# EAGLE design RPi_relay_board (EAGLE 6.4)
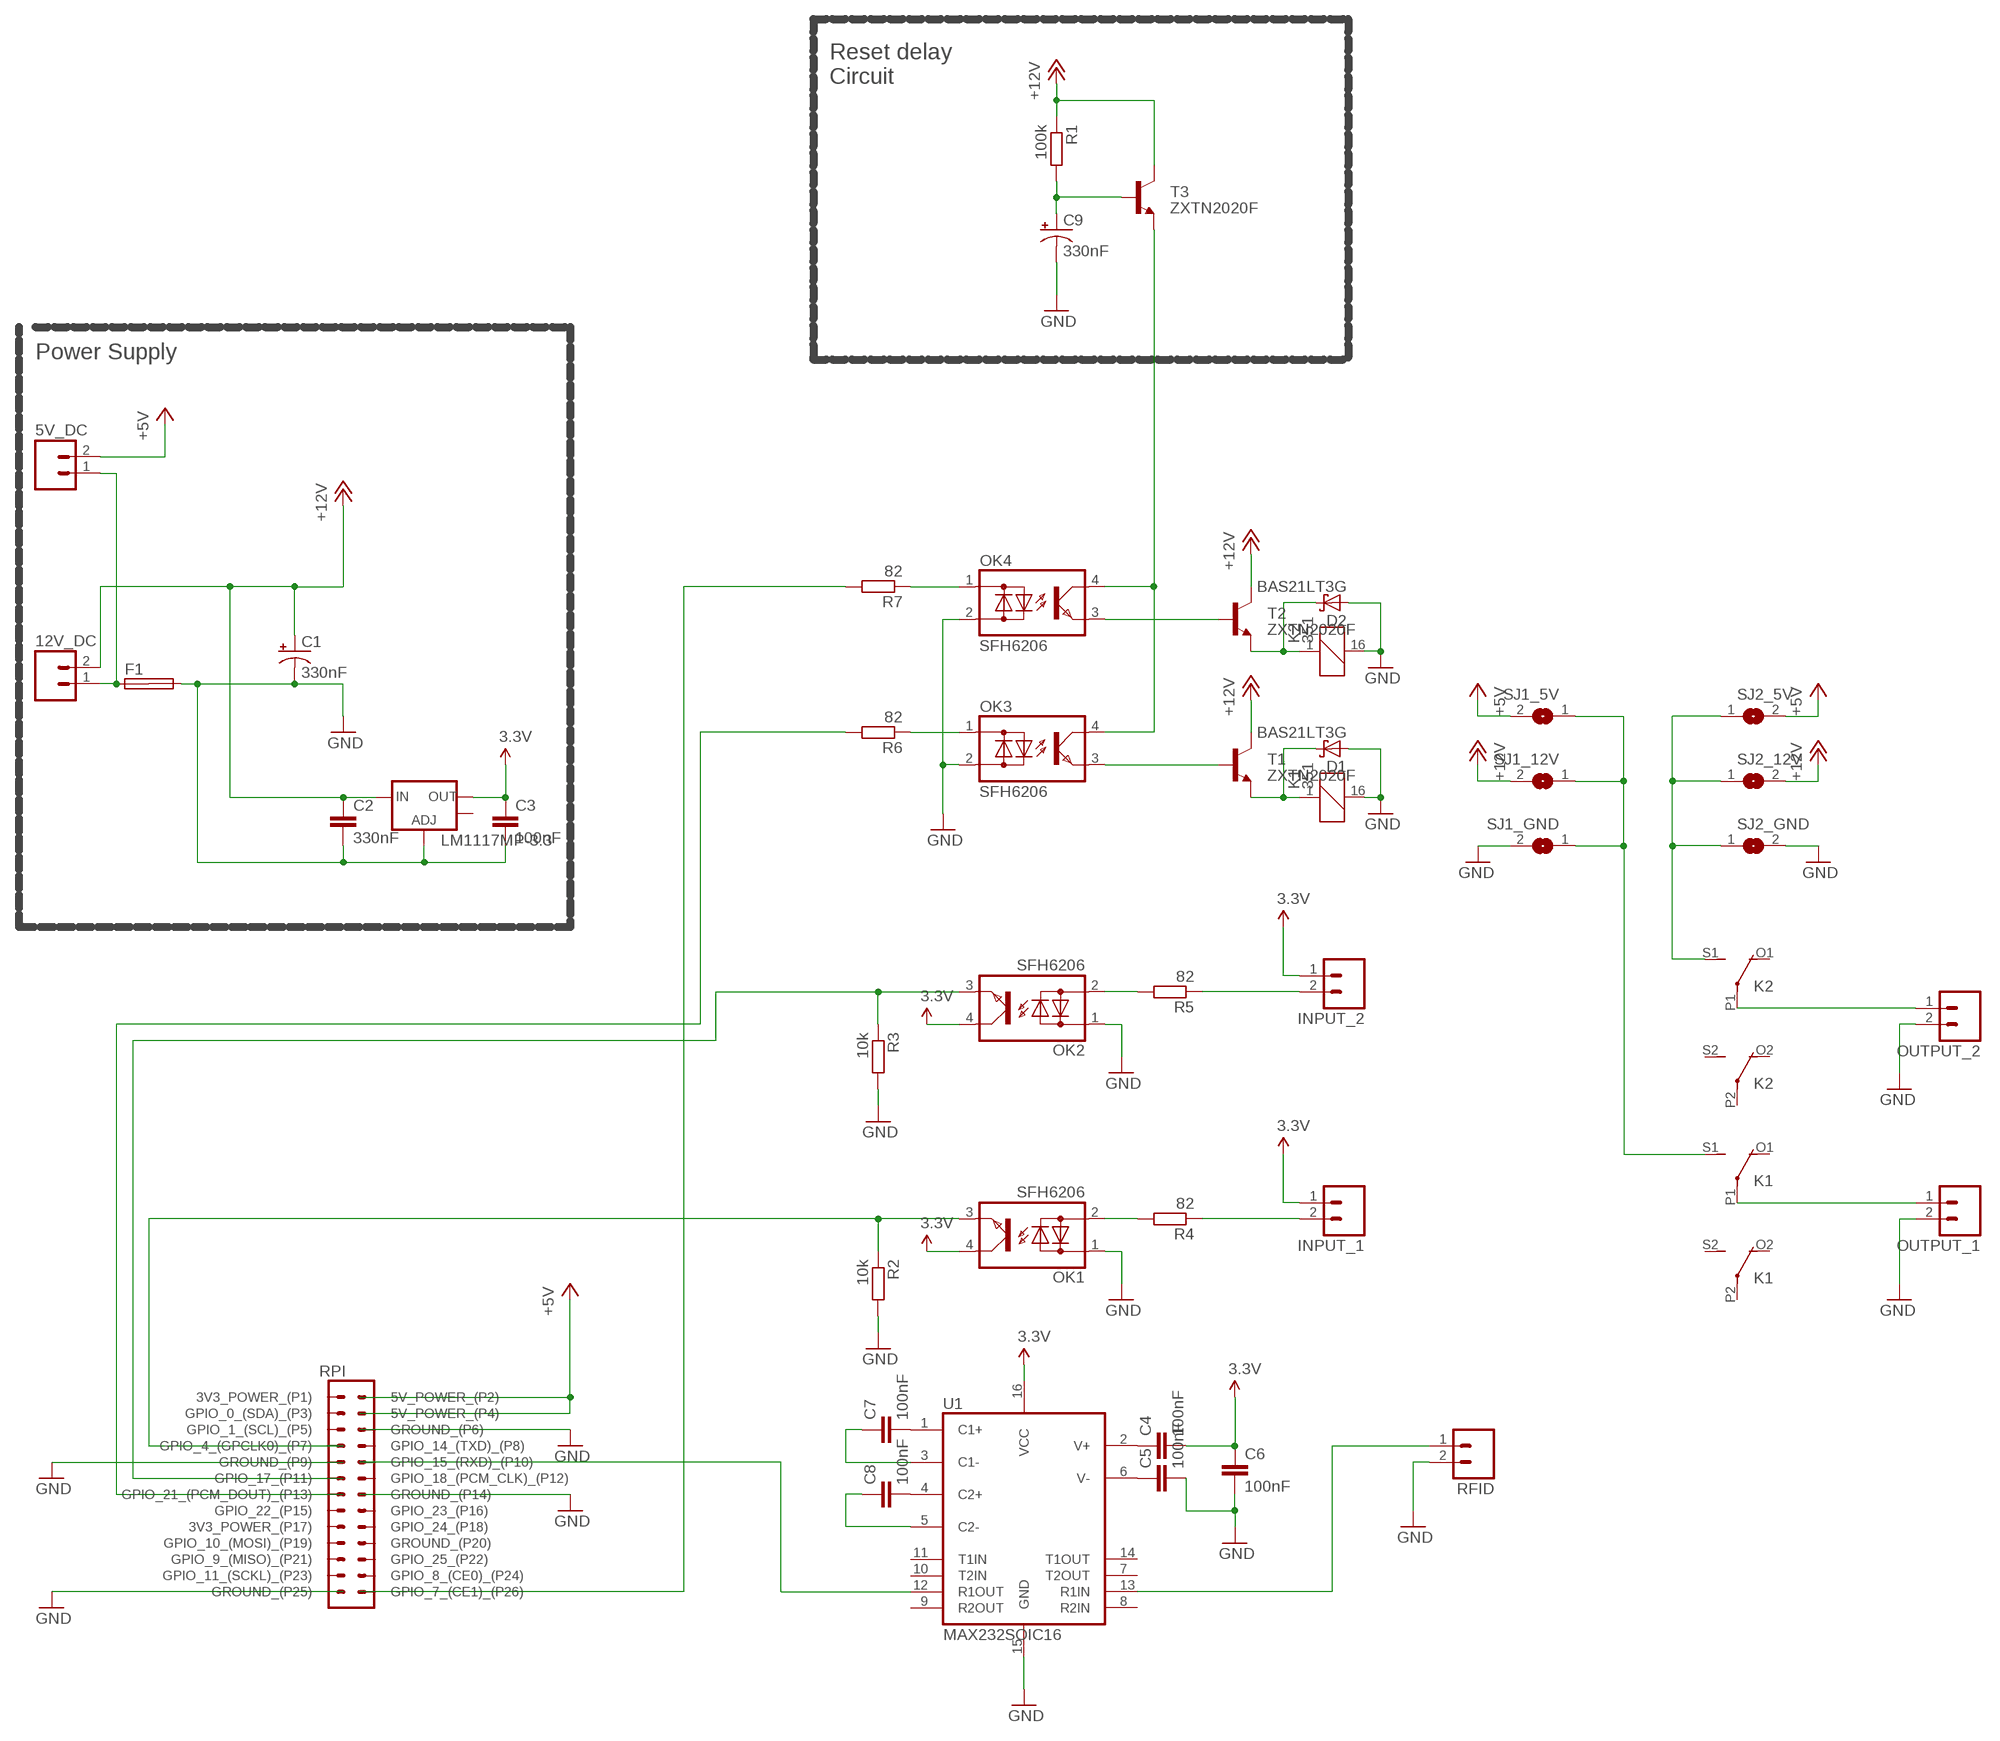
[diagram p0: schematic, sheet 1]

## Parts
5V_DC  M02PTH3_5MM  [1X02_LONGPADS]
12V_DC  M02PTH3_5MM  [1X02_LONGPADS]
C1  330nF  CAP_POL7343  [EIA7343]
C2  330nF  C-EUC3216  [C3216]
C3  100nF  C-EUC3216  [C3216]
C4  100nF  C-EUC2012  [C2012]
C5  100nF  C-EUC2012  [C2012]
C6  100nF  C-EUC2012  [C2012]
C7  100nF  C-EUC2012  [C2012]
C8  100nF  C-EUC2012  [C2012]
C9  330nF  CAP_POL7343  [EIA7343]
D1  BAS21LT3G  BAS40  [SOT23]
D2  BAS21LT3G  BAS40  [SOT23]
F1  SHK20L  [SHK20L]
INPUT_1  M02PTH3_5MM  [1X02_LONGPADS]
INPUT_2  M02PTH3_5MM  [1X02_LONGPADS]
K1  351  [351]
K2  351  [351]
LM1117MP-3.3  V_REG_LM1117SOT223  [SOT223]
OK1  SFH6206  [DIL4-SMD]
OK2  SFH6206  [DIL4-SMD]
OK3  SFH6206  [DIL4-SMD]
OK4  SFH6206  [DIL4-SMD]
OUTPUT_1  M02PTH3_5MM  [1X02_LONGPADS]
OUTPUT_2  M02PTH3_5MM  [1X02_LONGPADS]
R1  100k  R-EU_M0805  [M0805]
R2  10k  R-EU_M0805  [M0805]
R3  10k  R-EU_M0805  [M0805]
R4  82  R-EU_M0805  [M0805]
R5  82  R-EU_M0805  [M0805]
R6  82  R-EU_M0805  [M0805]
R7  82  R-EU_M0805  [M0805]
RFID  M02PTH3_5MM  [1X02_LONGPADS]
RPI  PINHD-2X13  [2X13]
SJ1_5V  SJW  [SJW]
SJ1_12V  SJW  [SJW]
SJ1_GND  SJW  [SJW]
SJ2_5V  SJW  [SJW]
SJ2_12V  SJW  [SJW]
SJ2_GND  SJW  [SJW]
T1  ZXTN2020F  TRANSISTOR_NPNSOT23  [SOT23]
T2  ZXTN2020F  TRANSISTOR_NPNSOT23  [SOT23]
T3  ZXTN2020F  TRANSISTOR_NPNSOT23  [SOT23]
U1  MAX232SOIC16  [SO016]

## Nets
3.3V: C3.1 C4.2 C6.1 INPUT_1.1 INPUT_2.1 LM1117MP-3.3.2(OUT) OK1.4(C) OK2.4(C) U1.16(VCC)
+5V [power]: 5V_DC.2 RPI.2(5V_POWER_(P2)) RPI.4(5V_POWER_(P4)) SJ1_5V.2 SJ2_5V.2
+12V: 12V_DC.2 C1.A(+) C2.1 LM1117MP-3.3.3(IN) R1.1 SJ1_12V.2 SJ2_12V.2 T1.3(C) T2.3(C) T3.3(C)
GND [power]: C1.C(-) C2.2 C3.2 C5.2 C6.2 C9.C(-) D1.1(A) D2.1(A) F1.2A K1.16 K2.16 LM1117MP-3.3.1(ADJ) OK1.1(AC1) OK2.1(AC1) OK3.2(AC2) OK4.2(AC2) OUTPUT_1.2 OUTPUT_2.2 R2.2 R3.2 RFID.2 RPI.6(GROUND_(P6)) RPI.9(GROUND_(P9)) RPI.14(GROUND_(P14)) RPI.25(GROUND_(P25)) SJ1_GND.2 SJ2_GND.2 U1.15(GND)
N$1: OK2.3(E) R3.1 RPI.11(GPIO_17_(P11))
N$2: OK1.2(AC2) R4.2
N$3: INPUT_1.2 R4.1
N$4: OK1.3(E) R2.1 RPI.7(GPIO_4_(GPCLK0)_(P7))
N$5: INPUT_2.2 R5.1
N$6: R7.2 RPI.26(GPIO_7_(CE1)_(P26))
N$7: OK4.3(E) T2.1(B)
N$8: OK3.3(E) T1.1(B)
N$9: OK2.2(AC2) R5.2
N$10: C9.A(+) R1.2 T3.1(B)
N$11: D2.3(C) K2.1 T2.2(E)
N$12: D1.3(C) K1.1 T1.2(E)
N$13: C7.2 U1.1(C1+)
N$14: OK3.4(C) OK4.4(C) T3.2(E)
N$15: RPI.10(GPIO_15_(RXD)_(P10)) U1.12(R1OUT)
N$16: RFID.1 U1.13(R1IN)
N$17: 5V_DC.1 12V_DC.1 F1.1A
N$18: K2.S1(2:S) SJ2_5V.1 SJ2_12V.1 SJ2_GND.1
N$19: OK4.1(AC1) R7.1
N$20: K1.S1(2:S) SJ1_5V.1 SJ1_12V.1 SJ1_GND.1
N$21: K2.P1(2:P) OUTPUT_2.1
N$22: K1.P1(2:P) OUTPUT_1.1
N$31: C8.2 U1.4(C2+)
N$32: C7.1 U1.3(C1-)
N$35: C8.1 U1.5(C2-)
N$36: C4.1 U1.2(V+)
N$37: C5.1 U1.6(V-)
N$44: R6.2 RPI.13(GPIO_21_(PCM_DOUT)_(P13))
N$51: OK3.1(AC1) R6.1
Unconnected: F1.1B F1.2B K1.O1(2:O) K1.O2(3:O) K1.P2(3:P) K1.S2(3:S) K2.O1(2:O) K2.O2(3:O) K2.P2(3:P) K2.S2(3:S) LM1117MP-3.3.4(OUT) RPI.1(3V3_POWER_(P1)) RPI.3(GPIO_0_(SDA)_(P3)) RPI.5(GPIO_1_(SCL)_(P5)) RPI.8(GPIO_14_(TXD)_(P8)) RPI.12(GPIO_18_(PCM_CLK)_(P12)) RPI.15(GPIO_22_(P15)) RPI.16(GPIO_23_(P16)) RPI.17(3V3_POWER_(P17)) RPI.18(GPIO_24_(P18)) RPI.19(GPIO_10_(MOSI)_(P19)) RPI.20(GROUND_(P20)) RPI.21(GPIO_9_(MISO)_(P21)) RPI.22(GPIO_25_(P22)) RPI.23(GPIO_11_(SCKL)_(P23)) RPI.24(GPIO_8_(CE0)_(P24)) U1.7(T2OUT) U1.8(R2IN) U1.9(R2OUT) U1.10(T2IN) U1.11(T1IN) U1.14(T1OUT)

## Notes on the sheet
- Reset delay
  Circuit
- Power Supply

## Library data of the parts
5V_DC 12V_DC INPUT_1 INPUT_2 OUTPUT_1 OUTPUT_2 RFID = SparkFun:M02: Header 2 Standard 2-pin 5 mm header
C1 C9 = SparkFun:CAP_POL: Capacitor Polarized These are standard SMD and PTH capacitors. Normally 10uF, 47uF, and 100uF in electrolytic and tantalum varieties. Always verify the external diameter of the through hole cap, it varies with capacity, voltage, and manufacturer. The EIA devices should be standard.
C2-C8 = rcl:C-EU: CAPACITOR, European symbol
D1 D2 = diode:BAS40: Silicon Schottky Diodes General-purpose diode for high-speed switching
F1 = fuse:SHK20L: FUSE HOLDER 5 x 20 mm, SH contact, SHH1 Schukat, E1073 Buerklin; OC_FARNELL: unknown; OC_NEWARK: unknown
K1 K2 = relay:351: RELAY 2 x switch, Omron; OC_FARNELL: unknown; OC_NEWARK: unknown
LM1117MP-3.3 = SparkFun:V_REG_LM1117: Voltage Regulator LM1117 Standard adjustable voltage regulator but in SMD form. Spark Fun Electronics SKU : COM-00595
OK1-OK4 = optocoupler:SFH620: Optocoupler, Phototransistor Output, AC Input Source: http://www.vishay.com/docs/83675/sfh620.pdf; MF: VISHAY/TELEFUNKEN; MPN: SFH6206-3; OC_FARNELL: 1469585; OC_NEWARK: 58K2214
R1-R7 = rcl:R-EU_: RESISTOR, European symbol
RPI = RPi_pinhead:PINHD-2X13: RPi 2x13 Pin Header
SJ1_5V SJ1_12V SJ1_GND SJ2_5V SJ2_12V SJ2_GND = jumper:SJ: SMD solder JUMPER
T1-T3 = SparkFun:TRANSISTOR_NPN: Transistor NPN BJT configuration in SOT23 package. MMBT2222 is the common NPN we use. Double check BCE configuration again layout.
U1 = SparkFun:MAX232: RS232 Transceiver Very common IC. This is generically called 'MAX232', but works with the 3V equivalent MAX3232 generic ICs. Field tested and mother approved. Spark Fun Electronics SKU : COM-00316 (DIP) and COM-00589 (SMD)

## Net classes
1 power: width 1.676 mm, clearance 0.508 mm

## Board
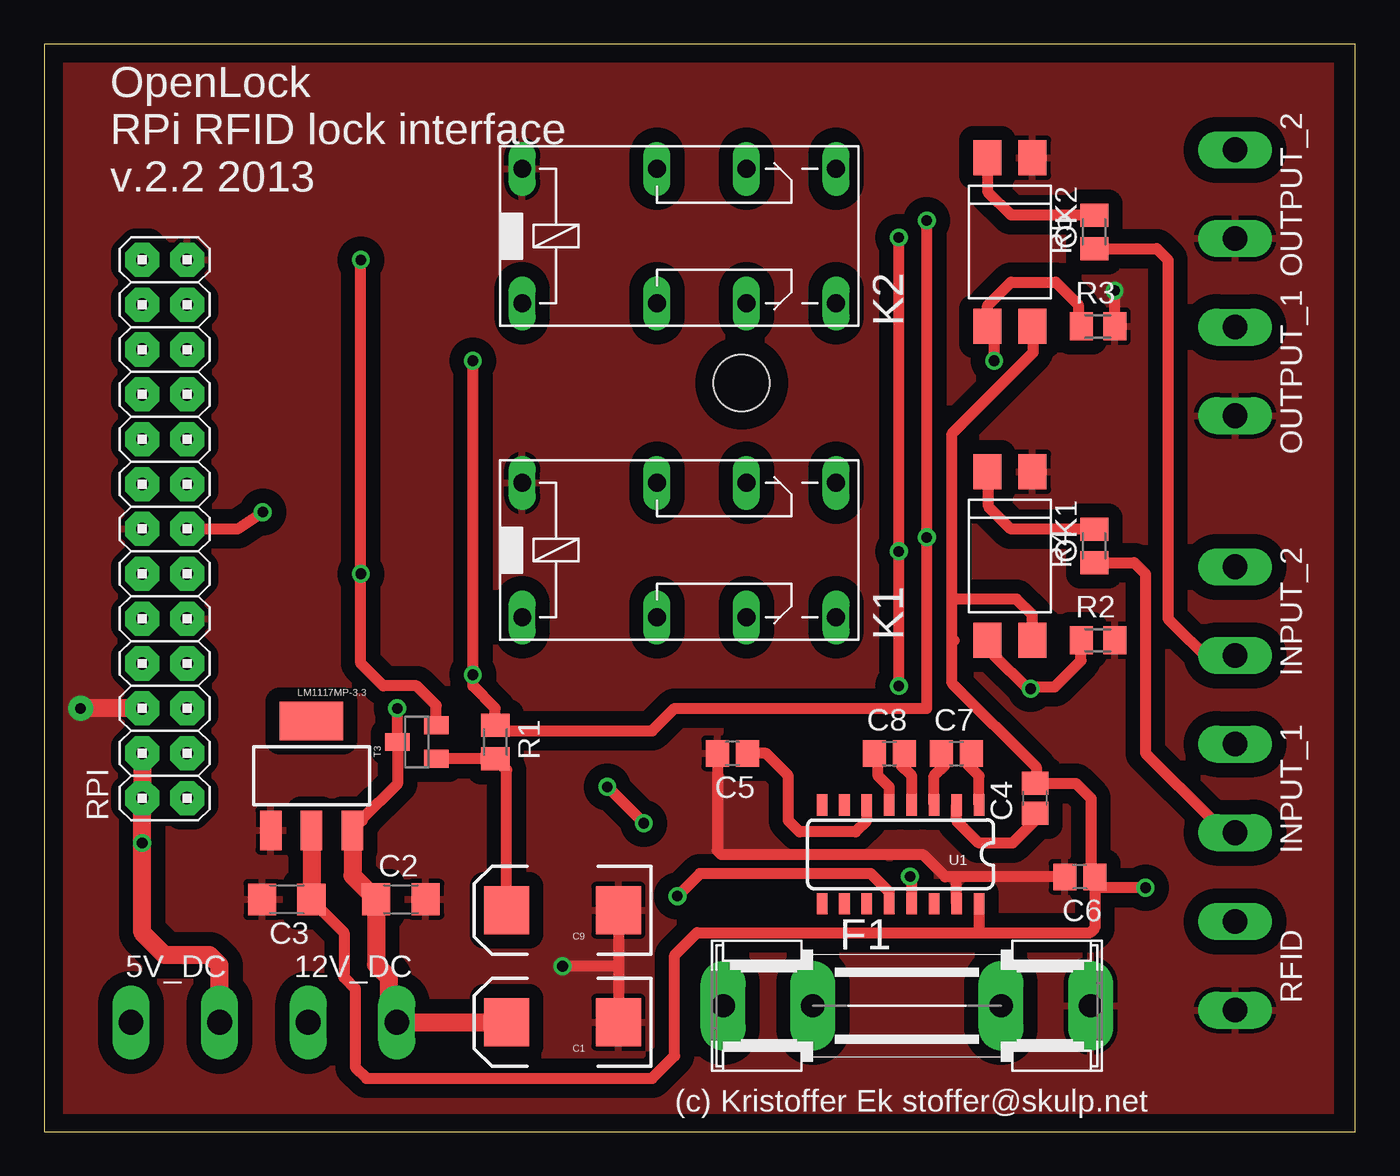
[diagram p1: board, top side]
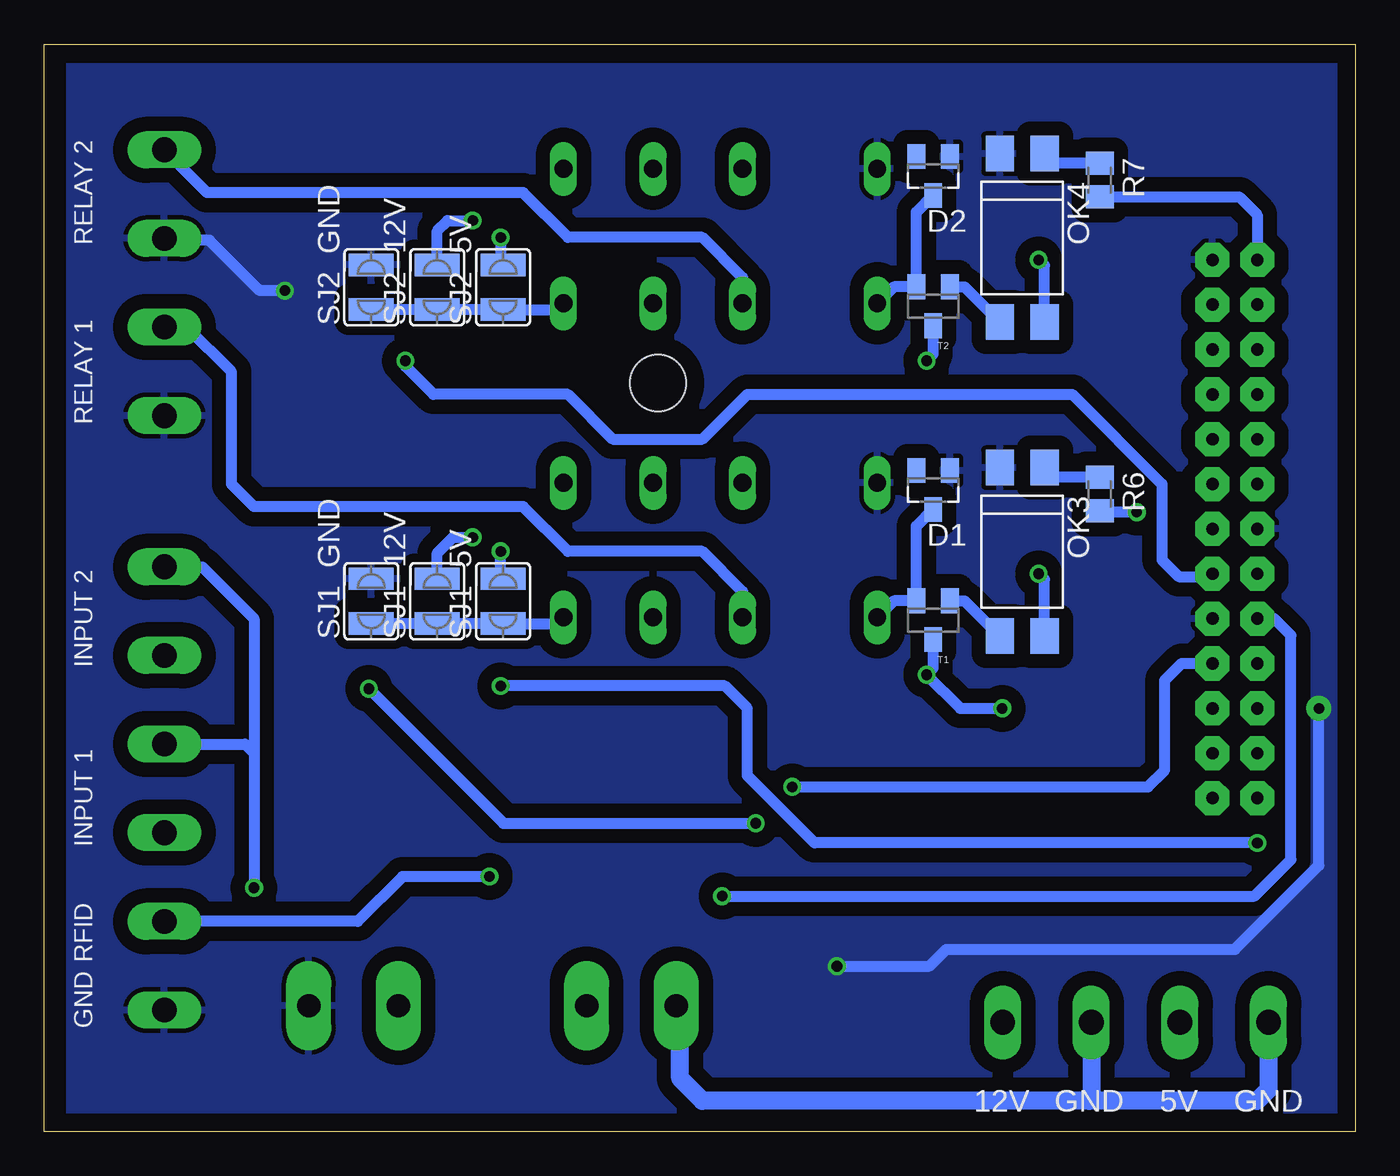
[diagram p2: board, bottom side, seen from below]

Size 74.28 x 61.58 mm. Coordinates in mm from the lower left corner, seen from the top.
Outline: 0,0 74.28,0 74.28,61.59 0,61.59 0,0
Copper layers (1*16): Top 0.035mm / dielectric 1.5mm / Bottom 0.035mm
Design rules "default": minimum track width 10mil, minimum drill 24mil, track to track 8mil, track to pad 8mil, pad to pad 8mil, via to via 8mil, smd to smd 8mil, copper to edge 40mil, drill to drill 8mil, minimum pad ring 10mil, minimum via ring 8mil, stop-mask expansion 4mil, vias tented up to drill 0mil, thermal gap 10mil
Holes 3.2 mm at 39.51,42.39

### Footprints (pad centres in the part's own frame; a part is rotated, then mirrored left to right if it is on the bottom)
1X02_LONGPADS = drill 1.4 pad 1.93 long: 1 0,0; 2 5.02,0
EIA7343 = smd 2.55 x 2.7: A 3.17,0; C -3.17,0
C3216 = smd 1.6 x 1.8: 1 -1.4,0; 2 1.4,0
C2012 = smd 1.3 x 1.5: 1 -0.85,0; 2 0.85,0
SOT23 = smd 1 x 1.4: 1 -0.95,-1.1; 2 0.95,-1.1; 3 0,1.1
SHK20L = drill 1.321 pad 2.54 long: 1A -10.414,0; 1B -5.334,0; 2A 10.414,0; 2B 5.334,0
351 = drill 1.016 long: 1 -3.81,-3.81; 16 -3.81,3.81; O1 8.89,-3.81; O2 8.89,3.81; P1 3.81,-3.81; P2 3.81,3.81; S1 13.97,-3.81; S2 13.97,3.81
SOT223 = smd 1.219 x 2.235: 1 -2.311,-3.099; 2 0,-3.099; 3 2.311,-3.099 | smd 3.6 x 2.2: 4 0,3.099
DIL4-SMD = smd 1.6 x 2: 1 -1.27,-4.77; 2 1.27,-4.77; 3 1.27,4.77; 4 -1.27,4.77
M0805 = smd 1.3 x 1.6: 1 -0.95,0; 2 0.95,0
2X13 = drill 0.7 pad 1.93 octagon: 1 -15.24,-1.27; 2 -15.24,1.27; 3 -12.7,-1.27; 4 -12.7,1.27; 5 -10.16,-1.27; 6 -10.16,1.27; 7 -7.62,-1.27; 8 -7.62,1.27; 9 -5.08,-1.27; 10 -5.08,1.27; 11 -2.54,-1.27; 12 -2.54,1.27; 13 0,-1.27; 14 0,1.27; 15 2.54,-1.27; 16 2.54,1.27; 17 5.08,-1.27; 18 5.08,1.27; 19 7.62,-1.27; 20 7.62,1.27; 21 10.16,-1.27; 22 10.16,1.27; 23 12.7,-1.27; 24 12.7,1.27; 25 15.24,-1.27; 26 15.24,1.27
SJW = smd 1.27 x 2.54: 1 -1.27,0; 2 1.27,0
SO016 = smd 0.6 x 1.2: 1 -4.445,-2.8; 2 -3.175,-2.8; 3 -1.905,-2.8; 4 -0.635,-2.8; 5 0.635,-2.8; 6 1.905,-2.8; 7 3.175,-2.8; 8 4.445,-2.8; 9 4.445,2.8; 10 3.175,2.8; 11 1.905,2.8; 12 0.635,2.8; 13 -0.635,2.8; 14 -1.905,2.8; 15 -3.175,2.8; 16 -4.445,2.8

### Placement (x,y rotation side)
5V_DC  4.92,6.19 0 top
12V_DC  14.96,6.19 0 top
C1  29.37,6.19 180 top
C2  20.21,13.16 0 top
C3  13.75,13.15 180 top
C4  56.13,18.88 90 top
C5  38.99,21.42 180 top
C6  58.67,14.43 180 top
C7  51.69,21.42 0 top
C8  47.88,21.42 0 top
C9  29.37,12.54 180 top
D1  23.92,36.34 180 bottom
D2  23.92,54.12 180 bottom
F1  48.88,7.13 0 top
INPUT_1  67.47,21.95 270 top
INPUT_2  67.47,31.99 270 top
K1  30.9,32.93 0 top
K2  30.9,50.71 0 top
LM1117MP-3.3  15.15,20.16 0 top
OK1  54.71,32.6 180 top
OK2  54.71,50.38 180 top
OK3  18.87,32.83 180 bottom
OK4  18.87,50.61 180 bottom
OUTPUT_1  67.47,45.56 270 top
OUTPUT_2  67.47,55.6 270 top
R1  25.56,22.07 270 top
R2  59.7,27.83 0 top
R3  59.7,45.61 0 top
R4  59.49,33.17 90 top
R5  59.49,50.95 90 top
R6  14.48,36.11 270 bottom
R7  14.48,53.89 270 bottom
RFID  67.47,11.91 270 top
RPI  6.83,34.13 90 top
SJ1_5V  48.29,30.04 90 bottom
SJ1_12V  52.02,30.04 90 bottom
SJ1_GND  55.75,30.04 90 bottom
SJ2_5V  48.29,47.82 90 bottom
SJ2_12V  52.02,47.82 90 bottom
SJ2_GND  55.75,47.82 90 bottom
T1  23.92,28.96 180 bottom
T2  23.92,46.74 180 bottom
T3  21.11,22.07 90 top
U1  48.51,15.7 180 top

### Tracks (layer width: path | path; a pad name or v marks a point on that pad's centre or on a via)
3.3V  (via drill 0.6)
  Top 0.61: C3.1 15.15,13.11 16.99,11.27 16.99,8.73 17.62,8.1 17.62,3.65 18.26,3.02 34.45,3.02 35.72,4.29 35.72,10 36.99,11.27 52.92,11.27 | 52.92,11.27 59.27,11.27 59.52,11.53 59.52,13.81 | U1.16 52.96,11.31 52.92,11.27 | 59.52,13.81 C6.1 59.31,14.65 59.31,18.88 58.46,19.73 C4.2 56.2,19.79 56.2,20.64 51.43,25.4 51.43,27.94 | v62.39,13.81 59.52,13.81 | 51.43,27.94 51.43,30.16 | 51.43,30.16 51.43,39.53 56.04,44.13 56.04,45.55 OK2.4 | 51.55,27.83 51.43,27.94 | OK1.4 55.98,29.27 55.09,30.16 51.43,30.16
  Top 1.016: LM1117MP-3.3.2 C3.1
  Bottom 0.61: INPUT_2.1 65.32,31.99 62.39,29.05 62.39,21.43 | 62.39,21.43 v62.39,13.81 | INPUT_1.1 62.9,21.95 62.39,21.43
+5V  (via drill 0.6)
  Top 0.61: v48.42,25.24 v48.42,32.86 v48.42,50.64
  Top 1.016: RPI.4 RPI.2 v5.56,16.35 5.56,11.27 6.83,10 9.37,10 9.94,9.43 5V_DC.2
  Bottom 0.61: v5.56,16.35 30.64,16.35 34.45,20.16 34.45,23.97 35.72,25.24 v48.42,25.24 | v48.42,50.64 48.42,49.22 SJ2_5V.2 | SJ1_5V.2 48.35,31.31 48.43,31.4 48.43,32.85 v48.42,32.86
+12V  (via drill 0.6)
  Top 0.61: LM1117MP-3.3.3 18.03,17.62 17.94,17.62 20.01,19.7 T3.3 v20,23.97 | v24.29,43.66 v24.29,25.88 24.29,25.24 25.56,23.97 R1.1 25.56,22.7 34.45,22.7 35.72,23.97 50.01,23.97 v50.01,33.66 v50.01,51.59
  Top 1.016: LM1117MP-3.3.3 17.46,14.5 C2.1 18.81,9.45 19.53,8.73 19.53,6.65 12V_DC.2 C1.A
  Bottom 0.61: T2.3 23.92,44.03 v24.29,43.66 | T1.3 23.92,26.25 v24.29,25.88 22.38,23.97 v20,23.97 | 51.91,49.2 SJ2_12V.2 52.02,51.01 51.43,51.59 v50.01,51.59 | SJ1_12V.2 52.02,32.76 51.12,33.66 v50.01,33.66
GND  (via drill 0.6, 0.6 pad 1.42)
  Top 0.61: C6.2 51.69,14.43 | 51.69,14.43 51.05,14.43 49.78,15.7 38.35,15.7 38.14,15.92 C5.2 | U1.15 51.69,14.43 | C1.C C9.C 32.54,9.52 32.38,9.37 v29.37,9.37 | R3.2 v60.65,47.62 v60.64,47.63
  Top 1.016: RPI.6 v2.06,23.97
  Bottom 0.61: v29.37,9.37 24.13,9.37 23.18,10.32 6.83,10.32 2.06,15.08 v2.06,23.97 | v60.64,47.63 62.07,47.63 64.93,50.48 67.37,50.48 OUTPUT_2.2
  pour Bottom (isolate 0.813): 1.11,60.8 72.87,60.8 72.87,0.48 1.11,0.48
  pour Top (isolate 0.813, rank 2): 1.11,60.8 72.87,60.8 72.87,0.48 1.11,0.48
N$1  (via drill 0.6)
  Top 0.61: R3.1 58.58,45.78 58.58,46.83 57.31,48.1 54.77,48.1 53.44,46.77 OK2.3 53.44,45.46 53.82,45.09 v53.82,43.66
  Bottom 0.61: v53.82,43.66 53.82,43.34 52.23,41.75 44.61,41.75 42.07,39.21 36.99,39.21 34.45,41.75 16.03,41.75 10.95,36.67 10.95,32.39 10,31.43 8.25,31.43 RPI.11
N$2
  Top 0.61: R4.2 54.78,34.12 53.5,35.4 53.5,37.31 OK1.2
N$3
  Top 0.61: R4.1 61.76,32.22 62.39,31.59 62.39,21.43 66.2,17.62 66.77,17.62 INPUT_1.2
N$4  (via drill 0.6)
  Top 0.61: v33.97,17.46 v31.91,19.53 | 53.44,27.52 OK1.3 53.82,27.45 53.82,26.99 55.72,25.08 v55.88,25.08 55.98,25.18 57.25,25.18 58.74,26.67 58.74,27.82 R2.1
  Bottom 0.61: v55.88,25.08 48.26,17.46 v33.97,17.46 | v31.91,19.53 11.75,19.53 10.79,20.48 10.79,25.56 9.84,26.51 RPI.7
N$5
  Top 0.61: R5.1 63.03,50 63.66,49.37 63.66,29.05 66.2,26.51 67.01,26.51 INPUT_2.2
N$6
  Bottom 0.61: R7.2 6.58,52.94 5.56,51.91 RPI.26
N$7
  Bottom 0.61: T2.1 22.14,47.84 OK4.3
N$8
  Bottom 0.61: T1.1 22.14,30.06 OK3.3
N$9
  Top 0.61: OK2.2 53.44,53.24 54.77,51.91 R5.2
N$10
  Top 0.61: C9.A 26.2,20.48 R1.2 T3.1
N$11
  Bottom 0.61: K2.1 26.15,47.84 T2.2 24.87,52.07 D2.3
N$12
  Bottom 0.61: K1.1 26.15,30.06 T1.2 24.87,34.28 D1.3
N$13
  Top 0.61: U1.1 52.96,20.15 52.32,20.78 52.32,21.2 C7.2
N$14  (via drill 0.6)
  Top 0.61: T3.2 22.21,24.14 21.11,25.24 19.21,25.24 17.94,26.51 v17.94,31.59 v17.94,49.37
  Bottom 0.61: OK4.4 17.6,49.04 v17.94,49.37 | OK3.4 17.6,31.26 v17.94,31.59
N$15  (via drill 0.6)
  Top 0.61: U1.12 47.88,13.56 46.83,14.61 37.15,14.61 v35.88,13.34
  Bottom 0.61: v35.88,13.34 5.71,13.34 3.65,15.4 3.65,28.1 4.6,29.05 RPI.10
N$16  (via drill 0.6)
  Top 0.61: U1.13 49.15,14.35 v49.05,14.45
  Bottom 0.61: v49.05,14.45 53.97,14.45 56.51,11.91 RFID.1
N$17
  Bottom 1.016: 5V_DC.1 4.92,2.38 5.56,1.75 15.08,1.75 | 15.08,1.75 36.99,1.75 38.26,3.02 38.26,6.92 F1.1A | 12V_DC.1 14.96,1.87 15.08,1.75
N$18
  Bottom 0.61: K2.S1 45.22,46.55 SJ2_5V.1 SJ2_12V.1 SJ2_GND.1
N$19
  Bottom 0.61: R7.1 17.06,54.84 OK4.1
N$20
  Bottom 0.61: K1.S1 45.22,28.77 SJ1_5V.1 SJ1_12V.1 SJ1_GND.1
N$21
  Bottom 0.61: K2.P1 34.71,48.36 36.99,50.64 44.61,50.64 47.15,53.18 65.05,53.18 OUTPUT_2.1
N$22
  Bottom 0.61: K1.P1 34.71,30.58 36.99,32.86 44.61,32.86 47.15,35.4 62.39,35.4 63.66,36.67 63.66,43.02 66.2,45.56 OUTPUT_1.1
N$31
  Top 0.61: U1.4 49.15,20.15 48.51,20.78 48.51,21.2 C8.2
N$32
  Top 0.61: U1.3 50.42,20.15 51.05,20.78 51.05,21.2 C7.1
N$35
  Top 0.61: U1.5 47.88,19.51 47.24,20.15 47.24,21.2 C8.1
N$36
  Top 0.61: C4.1 56.13,17.61 54.86,16.34 52.96,16.34 51.69,17.61 U1.2
N$37
  Top 0.61: U1.6 46.61,17.61 45.97,16.97 42.8,16.97 42.16,17.61 42.16,20.15 40.89,21.42 C5.1
N$44  (via drill 0.6)
  Top 0.61: RPI.13 10.95,34.13 v12.38,35.08
  Bottom 0.61: v12.38,35.08 14.4,35.08 R6.2
N$51
  Bottom 0.61: R6.1 17.06,37.06 OK3.1

### Text on the board
tNames: OpenLock / RPi RFID lock interface / v.2.2 2013 | (c) Kristoffer Ek stoffer@skulp.net
bNames: RELAY 2 | RELAY 1 | INPUT 2 | INPUT 1 | RFID | GND | GND | 5V | GND | 12V